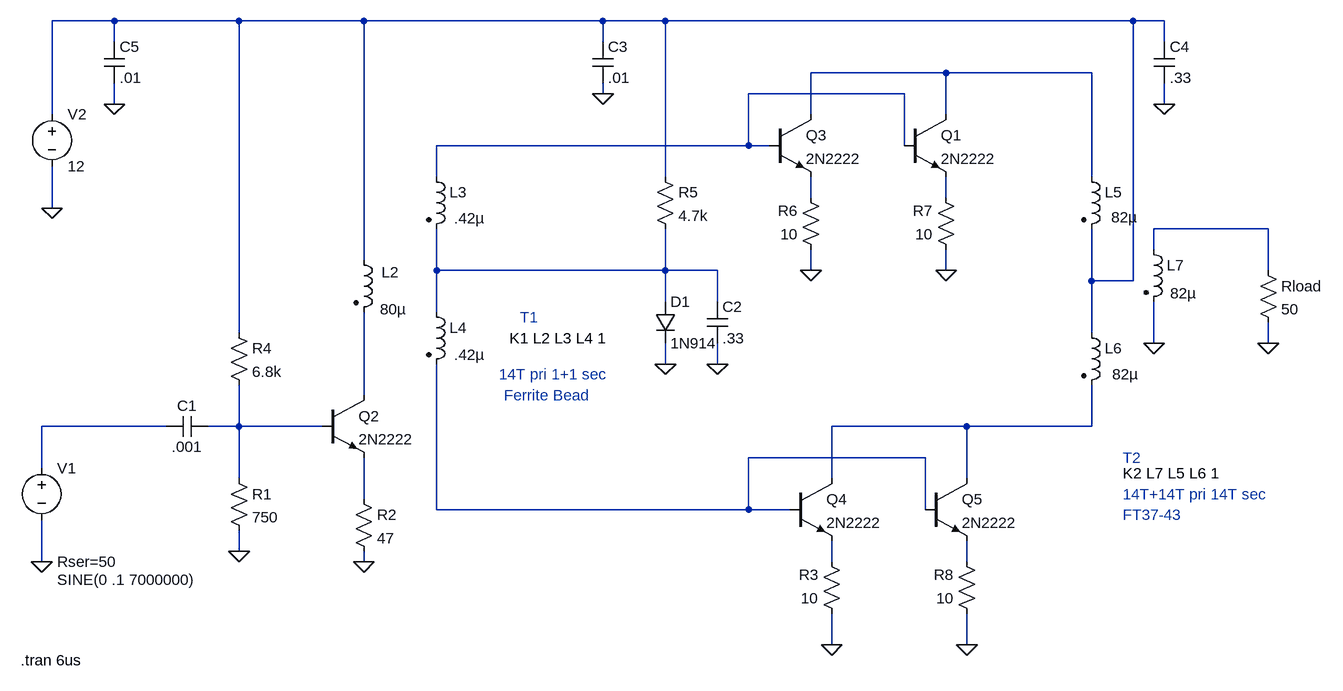
[diagram p0: schematic sm0vpohalfwatt.asc]
sm0vpohalfwatt.asc, the LTspice schematic file:
Version 4
SHEET 1 2092 1048
WIRE -48 -336 -144 -336
WIRE 144 -336 -48 -336
WIRE 336 -336 144 -336
WIRE 704 -336 336 -336
WIRE 800 -336 704 -336
WIRE 1520 -336 800 -336
WIRE 1568 -336 1520 -336
WIRE -48 -304 -48 -336
WIRE 704 -304 704 -336
WIRE 1568 -304 1568 -336
WIRE 1232 -256 1024 -256
WIRE 1456 -256 1232 -256
WIRE 704 -224 704 -240
WIRE 1168 -224 928 -224
WIRE -48 -208 -48 -240
WIRE 1568 -208 1568 -240
WIRE -144 -192 -144 -336
WIRE 1024 -192 1024 -256
WIRE 1232 -192 1232 -256
WIRE 928 -144 928 -224
WIRE 928 -144 448 -144
WIRE 960 -144 928 -144
WIRE 1168 -144 1168 -224
WIRE 448 -96 448 -144
WIRE 800 -96 800 -336
WIRE 1456 -96 1456 -256
WIRE 1024 -64 1024 -96
WIRE 1232 -64 1232 -96
WIRE -144 -48 -144 -112
WIRE 1728 -16 1552 -16
WIRE 1552 16 1552 -16
WIRE 336 32 336 -336
WIRE 448 48 448 -16
WIRE 800 48 800 -16
WIRE 800 48 448 48
WIRE 880 48 800 48
WIRE 1024 48 1024 16
WIRE 1232 48 1232 16
WIRE 1728 48 1728 -16
WIRE 1456 64 1456 -16
WIRE 1520 64 1520 -336
WIRE 1520 64 1456 64
WIRE 800 96 800 48
WIRE 880 96 880 48
WIRE 448 112 448 48
WIRE 144 144 144 -336
WIRE 1456 144 1456 64
WIRE 1552 160 1552 96
WIRE 1728 160 1728 128
WIRE 800 192 800 160
WIRE 880 192 880 160
WIRE 336 240 336 112
WIRE 32 288 -160 288
WIRE 144 288 144 224
WIRE 144 288 96 288
WIRE 272 288 144 288
WIRE 1264 288 1056 288
WIRE 1456 288 1456 224
WIRE 1456 288 1264 288
WIRE 1200 336 928 336
WIRE -160 352 -160 288
WIRE 144 368 144 288
WIRE 1056 368 1056 288
WIRE 1264 368 1264 288
WIRE 336 400 336 336
WIRE 448 416 448 192
WIRE 928 416 928 336
WIRE 928 416 448 416
WIRE 992 416 928 416
WIRE 1200 416 1200 336
WIRE 144 480 144 448
WIRE -160 496 -160 432
WIRE 336 496 336 480
WIRE 1056 496 1056 464
WIRE 1264 496 1264 464
WIRE 1056 624 1056 576
WIRE 1264 624 1264 576
FLAG -160 496 0
FLAG -144 -48 0
FLAG 1024 48 0
FLAG 1552 160 0
FLAG 1728 160 0
FLAG 144 480 0
FLAG 336 496 0
FLAG 800 192 0
FLAG 880 192 0
FLAG 1056 624 0
FLAG 1232 48 0
FLAG 1264 624 0
FLAG 1568 -208 0
FLAG 704 -224 0
FLAG -48 -208 0
SYMBOL voltage -160 336 R0
WINDOW 3 24 188 Left 0
WINDOW 39 24 160 Left 0
WINDOW 123 24 44 Left 0
SYMATTR Value SINE(0 .1 7000000)
SYMATTR SpiceLine Rser=50
SYMATTR InstName V1
SYMBOL cap 96 272 R90
WINDOW 0 0 32 VBottom 0
WINDOW 3 32 32 VTop 0
SYMATTR InstName C1
SYMATTR Value .001
SYMBOL npn 272 240 R0
SYMATTR InstName Q2
SYMATTR Value 2N2222
SYMBOL res 320 384 R0
SYMATTR InstName R2
SYMATTR Value 47
SYMBOL cap 864 96 R0
SYMATTR InstName C2
SYMATTR Value .33
SYMBOL res 128 128 R0
SYMATTR InstName R4
SYMATTR Value 6.8k
SYMBOL voltage -144 -208 R0
WINDOW 39 0 0 Left 0
WINDOW 123 0 0 Left 0
SYMATTR InstName V2
SYMATTR Value 12
SYMBOL ind2 320 16 R0
WINDOW 0 43 35 Left 0
WINDOW 3 41 92 Left 0
SYMATTR InstName L2
SYMATTR Value 80µ
SYMATTR Type ind
SYMBOL ind2 432 -112 R0
WINDOW 3 43 80 Left 0
SYMATTR Value .42µ
SYMATTR InstName L3
SYMATTR Type ind
SYMBOL ind2 432 96 R0
WINDOW 3 43 82 Left 0
SYMATTR Value .42µ
SYMATTR InstName L4
SYMATTR Type ind
SYMBOL res 784 -112 R0
SYMATTR InstName R5
SYMATTR Value 4.7k
SYMBOL npn 960 -192 R0
SYMATTR InstName Q3
SYMATTR Value 2N2222
SYMBOL npn 992 368 R0
SYMATTR InstName Q4
SYMATTR Value 2N2222
SYMBOL res 1040 32 R180
WINDOW 0 36 76 Left 0
WINDOW 3 36 40 Left 0
SYMATTR InstName R6
SYMATTR Value 10
SYMBOL ind2 1440 -112 R0
WINDOW 3 46 78 Left 0
SYMATTR Value 82µ
SYMATTR InstName L5
SYMATTR Type ind
SYMBOL ind2 1440 128 R0
WINDOW 3 48 80 Left 0
SYMATTR Value 82µ
SYMATTR InstName L6
SYMATTR Type ind
SYMBOL ind2 1536 0 R0
WINDOW 3 41 83 Left 0
SYMATTR Value 82µ
SYMATTR InstName L7
SYMATTR Type ind
SYMBOL res 1712 32 R0
SYMATTR InstName Rload
SYMATTR Value 50
SYMBOL res 128 352 R0
SYMATTR InstName R1
SYMATTR Value 750
SYMBOL cap 688 -304 R0
SYMATTR InstName C3
SYMATTR Value .01
SYMBOL diode 784 96 R0
SYMATTR InstName D1
SYMATTR Value 1N914
SYMBOL res 1072 592 R180
WINDOW 0 36 76 Left 0
WINDOW 3 36 40 Left 0
SYMATTR InstName R3
SYMATTR Value 10
SYMBOL npn 1168 -192 R0
SYMATTR InstName Q1
SYMATTR Value 2N2222
SYMBOL npn 1200 368 R0
SYMATTR InstName Q5
SYMATTR Value 2N2222
SYMBOL res 1248 32 R180
WINDOW 0 36 76 Left 0
WINDOW 3 36 40 Left 0
SYMATTR InstName R7
SYMATTR Value 10
SYMBOL res 1280 592 R180
WINDOW 0 36 76 Left 0
WINDOW 3 36 40 Left 0
SYMATTR InstName R8
SYMATTR Value 10
SYMBOL cap 1552 -304 R0
SYMATTR InstName C4
SYMATTR Value .33
SYMBOL cap -64 -304 R0
SYMATTR InstName C5
SYMATTR Value .01
TEXT 560 152 Left 0 !K1 L2 L3 L4 1
TEXT 576 120 Left 0 ;T1
TEXT 1504 360 Left 0 !K2 L7 L5 L6 1
TEXT 1504 336 Left 0 ;T2
TEXT -192 648 Left 0 !.tran 6us
TEXT 544 208 Left 0 ;14T pri 1+1 sec
TEXT 552 240 Left 0 ;Ferrite Bead
TEXT 1504 424 Left 0 ;FT37-43
TEXT 1504 392 Left 0 ;14T+14T pri 14T sec

The netlist it stands for:
* sm0vpohalfwatt.asc
V1 N009 0 SINE(0 .1 7000000) Rser=50
C1 N010 N009 .001
Q2 N008 N010 N013 0 2N2222
R2 N013 0 47
C2 N007 0 .33
R4 N001 N010 6.8k
V2 N001 0 12
L2 N001 N008 80µ
L3 N003 N007 .42µ
L4 N007 N012 .42µ
R5 N001 N007 4.7k
Q3 N002 N003 N004 0 2N2222
Q4 N011 N012 N014 0 2N2222
R6 0 N004 10
L5 N002 N001 82µ
L6 N001 N011 82µ
L7 N006 0 82µ
Rload N006 0 50
R1 N010 0 750
C3 N001 0 .01
D1 N007 0 1N914
R3 0 N014 10
Q1 N002 N003 N005 0 2N2222
Q5 N011 N012 N015 0 2N2222
R7 0 N005 10
R8 0 N015 10
C4 N001 0 .33
C5 N001 0 .01
.model D D
.lib standard.dio
.model NPN NPN
.model PNP PNP
.lib standard.bjt
K1 L2 L3 L4 1
* T1
K2 L7 L5 L6 1
* T2
.tran 6us
* 14T pri 1+1 sec
* Ferrite Bead
* FT37-43
* 14T+14T pri 14T sec
.backanno
.end